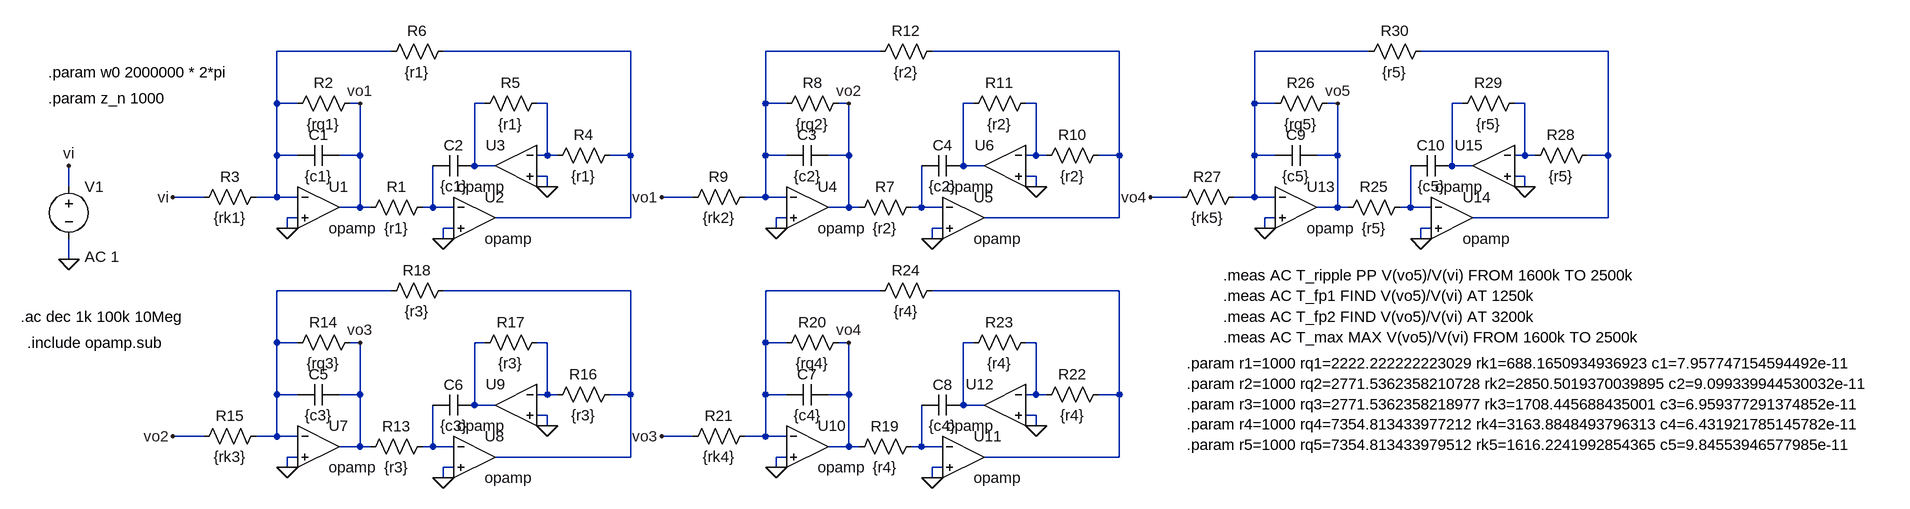
[diagram p0: schematic sim.asc]
sim.asc, the LTspice schematic file:
Version 4
SHEET 1 5660 900
WIRE 976 224 800 224
WIRE 1344 224 1056 224
WIRE 1728 224 1552 224
WIRE 2096 224 1808 224
WIRE 2480 224 2304 224
WIRE 2848 224 2560 224
WIRE 800 304 800 224
WIRE 832 304 800 304
WIRE 928 304 912 304
WIRE 1120 304 1104 304
WIRE 1216 304 1200 304
WIRE 1552 304 1552 224
WIRE 1584 304 1552 304
WIRE 1680 304 1664 304
WIRE 1872 304 1856 304
WIRE 1968 304 1952 304
WIRE 2304 304 2304 224
WIRE 2336 304 2304 304
WIRE 2432 304 2416 304
WIRE 2624 304 2608 304
WIRE 2720 304 2704 304
WIRE 800 384 800 304
WIRE 832 384 800 384
WIRE 928 384 928 304
WIRE 928 384 896 384
WIRE 1216 384 1216 304
WIRE 1216 384 1200 384
WIRE 1232 384 1216 384
WIRE 1344 384 1344 224
WIRE 1344 384 1312 384
WIRE 1552 384 1552 304
WIRE 1584 384 1552 384
WIRE 1680 384 1680 304
WIRE 1680 384 1648 384
WIRE 1968 384 1968 304
WIRE 1968 384 1952 384
WIRE 1984 384 1968 384
WIRE 2096 384 2096 224
WIRE 2096 384 2064 384
WIRE 2304 384 2304 304
WIRE 2336 384 2304 384
WIRE 2432 384 2432 304
WIRE 2432 384 2400 384
WIRE 2720 384 2720 304
WIRE 2720 384 2704 384
WIRE 2736 384 2720 384
WIRE 2848 384 2848 224
WIRE 2848 384 2816 384
WIRE 1104 400 1104 304
WIRE 1136 400 1104 400
WIRE 1856 400 1856 304
WIRE 1888 400 1856 400
WIRE 2608 400 2608 304
WIRE 2640 400 2608 400
WIRE 1216 416 1200 416
WIRE 1968 416 1952 416
WIRE 2720 416 2704 416
WIRE 480 432 480 400
WIRE 1216 432 1216 416
WIRE 1968 432 1968 416
WIRE 2720 432 2720 416
WIRE 688 448 640 448
WIRE 800 448 800 384
WIRE 800 448 768 448
WIRE 832 448 800 448
WIRE 1440 448 1392 448
WIRE 1552 448 1552 384
WIRE 1552 448 1520 448
WIRE 1584 448 1552 448
WIRE 2192 448 2144 448
WIRE 2304 448 2304 384
WIRE 2304 448 2272 448
WIRE 2336 448 2304 448
WIRE 928 464 928 384
WIRE 928 464 896 464
WIRE 944 464 928 464
WIRE 1040 464 1040 400
WIRE 1040 464 1024 464
WIRE 1072 464 1040 464
WIRE 1680 464 1680 384
WIRE 1680 464 1648 464
WIRE 1696 464 1680 464
WIRE 1792 464 1792 400
WIRE 1792 464 1776 464
WIRE 1824 464 1792 464
WIRE 2432 464 2432 384
WIRE 2432 464 2400 464
WIRE 2448 464 2432 464
WIRE 2544 464 2544 400
WIRE 2544 464 2528 464
WIRE 2576 464 2544 464
WIRE 832 480 816 480
WIRE 1344 480 1344 384
WIRE 1344 480 1136 480
WIRE 1584 480 1568 480
WIRE 2096 480 2096 384
WIRE 2096 480 1888 480
WIRE 2336 480 2320 480
WIRE 2848 480 2848 384
WIRE 2848 480 2640 480
WIRE 816 496 816 480
WIRE 1072 496 1056 496
WIRE 1568 496 1568 480
WIRE 1824 496 1808 496
WIRE 2320 496 2320 480
WIRE 2576 496 2560 496
WIRE 1056 512 1056 496
WIRE 1808 512 1808 496
WIRE 2560 512 2560 496
WIRE 480 544 480 512
WIRE 976 592 800 592
WIRE 1344 592 1056 592
WIRE 1728 592 1552 592
WIRE 2096 592 1808 592
WIRE 800 672 800 592
WIRE 832 672 800 672
WIRE 928 672 912 672
WIRE 1120 672 1104 672
WIRE 1216 672 1200 672
WIRE 1552 672 1552 592
WIRE 1584 672 1552 672
WIRE 1680 672 1664 672
WIRE 1872 672 1856 672
WIRE 1968 672 1952 672
WIRE 800 752 800 672
WIRE 832 752 800 752
WIRE 928 752 928 672
WIRE 928 752 896 752
WIRE 1216 752 1216 672
WIRE 1216 752 1200 752
WIRE 1232 752 1216 752
WIRE 1344 752 1344 592
WIRE 1344 752 1312 752
WIRE 1552 752 1552 672
WIRE 1584 752 1552 752
WIRE 1680 752 1680 672
WIRE 1680 752 1648 752
WIRE 1968 752 1968 672
WIRE 1968 752 1952 752
WIRE 1984 752 1968 752
WIRE 2096 752 2096 592
WIRE 2096 752 2064 752
WIRE 1104 768 1104 672
WIRE 1136 768 1104 768
WIRE 1856 768 1856 672
WIRE 1888 768 1856 768
WIRE 1216 784 1200 784
WIRE 1968 784 1952 784
WIRE 1216 800 1216 784
WIRE 1968 800 1968 784
WIRE 688 816 640 816
WIRE 800 816 800 752
WIRE 800 816 768 816
WIRE 832 816 800 816
WIRE 1440 816 1392 816
WIRE 1552 816 1552 752
WIRE 1552 816 1520 816
WIRE 1584 816 1552 816
WIRE 928 832 928 752
WIRE 928 832 896 832
WIRE 944 832 928 832
WIRE 1040 832 1040 768
WIRE 1040 832 1024 832
WIRE 1072 832 1040 832
WIRE 1680 832 1680 752
WIRE 1680 832 1648 832
WIRE 1696 832 1680 832
WIRE 1792 832 1792 768
WIRE 1792 832 1776 832
WIRE 1824 832 1792 832
WIRE 832 848 816 848
WIRE 1344 848 1344 752
WIRE 1344 848 1136 848
WIRE 1584 848 1568 848
WIRE 2096 848 2096 752
WIRE 2096 848 1888 848
WIRE 816 864 816 848
WIRE 1072 864 1056 864
WIRE 1568 864 1568 848
WIRE 1824 864 1808 864
WIRE 1056 880 1056 864
WIRE 1808 880 1808 864
FLAG 816 496 0
FLAG 1056 512 0
FLAG 1216 432 0
FLAG 480 544 0
FLAG 480 400 vi
FLAG 640 448 vi
FLAG 928 304 vo1
FLAG 1568 496 0
FLAG 1808 512 0
FLAG 1968 432 0
FLAG 1392 448 vo1
FLAG 1680 304 vo2
FLAG 816 864 0
FLAG 1056 880 0
FLAG 1216 800 0
FLAG 640 816 vo2
FLAG 928 672 vo3
FLAG 1568 864 0
FLAG 1808 880 0
FLAG 1968 800 0
FLAG 1392 816 vo3
FLAG 1680 672 vo4
FLAG 2320 496 0
FLAG 2560 512 0
FLAG 2720 432 0
FLAG 2144 448 vo4
FLAG 2432 304 vo5
SYMBOL OpAmps\\opamp 864 400 R0
SYMATTR InstName U1
SYMATTR SpiceLine2 GBW=10G
SYMBOL OpAmps\\opamp 1104 416 R0
SYMATTR InstName U2
SYMATTR SpiceLine2 GBW=10G
SYMBOL res 1040 448 R90
WINDOW 0 0 56 VBottom 2
WINDOW 3 32 56 VTop 2
SYMATTR InstName R1
SYMATTR Value {r1}
SYMBOL cap 896 368 R90
WINDOW 0 0 32 VBottom 2
WINDOW 3 32 32 VTop 2
SYMATTR InstName C1
SYMATTR Value {c1}
SYMBOL res 928 288 R90
WINDOW 0 0 56 VBottom 2
WINDOW 3 32 56 VTop 2
SYMATTR InstName R2
SYMATTR Value {rq1}
SYMBOL res 784 432 R90
WINDOW 0 0 56 VBottom 2
WINDOW 3 32 56 VTop 2
SYMATTR InstName R3
SYMATTR Value {rk1}
SYMBOL OpAmps\\opamp 1168 336 M0
SYMATTR InstName U3
SYMATTR SpiceLine2 GBW=10G
SYMBOL res 1328 368 R90
WINDOW 0 0 56 VBottom 2
WINDOW 3 32 56 VTop 2
SYMATTR InstName R4
SYMATTR Value {r1}
SYMBOL res 1216 288 R90
WINDOW 0 0 56 VBottom 2
WINDOW 3 32 56 VTop 2
SYMATTR InstName R5
SYMATTR Value {r1}
SYMBOL cap 1104 384 R90
WINDOW 0 0 32 VBottom 2
WINDOW 3 32 32 VTop 2
SYMATTR InstName C2
SYMATTR Value {c1}
SYMBOL res 1072 208 R90
WINDOW 0 0 56 VBottom 2
WINDOW 3 32 56 VTop 2
SYMATTR InstName R6
SYMATTR Value {r1}
SYMBOL voltage 480 416 R0
WINDOW 123 24 124 Left 2
WINDOW 39 0 0 Left 0
SYMATTR InstName V1
SYMATTR Value ""
SYMATTR Value2 AC 1
SYMBOL OpAmps\\opamp 1616 400 R0
SYMATTR InstName U4
SYMATTR SpiceLine2 GBW=10G
SYMBOL OpAmps\\opamp 1856 416 R0
SYMATTR InstName U5
SYMATTR SpiceLine2 GBW=10G
SYMBOL res 1792 448 R90
WINDOW 0 0 56 VBottom 2
WINDOW 3 32 56 VTop 2
SYMATTR InstName R7
SYMATTR Value {r2}
SYMBOL cap 1648 368 R90
WINDOW 0 0 32 VBottom 2
WINDOW 3 32 32 VTop 2
SYMATTR InstName C3
SYMATTR Value {c2}
SYMBOL res 1680 288 R90
WINDOW 0 0 56 VBottom 2
WINDOW 3 32 56 VTop 2
SYMATTR InstName R8
SYMATTR Value {rq2}
SYMBOL res 1536 432 R90
WINDOW 0 0 56 VBottom 2
WINDOW 3 32 56 VTop 2
SYMATTR InstName R9
SYMATTR Value {rk2}
SYMBOL OpAmps\\opamp 1920 336 M0
SYMATTR InstName U6
SYMATTR SpiceLine2 GBW=10G
SYMBOL res 2080 368 R90
WINDOW 0 0 56 VBottom 2
WINDOW 3 32 56 VTop 2
SYMATTR InstName R10
SYMATTR Value {r2}
SYMBOL res 1968 288 R90
WINDOW 0 0 56 VBottom 2
WINDOW 3 32 56 VTop 2
SYMATTR InstName R11
SYMATTR Value {r2}
SYMBOL cap 1856 384 R90
WINDOW 0 0 32 VBottom 2
WINDOW 3 32 32 VTop 2
SYMATTR InstName C4
SYMATTR Value {c2}
SYMBOL res 1824 208 R90
WINDOW 0 0 56 VBottom 2
WINDOW 3 32 56 VTop 2
SYMATTR InstName R12
SYMATTR Value {r2}
SYMBOL OpAmps\\opamp 864 768 R0
SYMATTR InstName U7
SYMATTR SpiceLine2 GBW=10G
SYMBOL OpAmps\\opamp 1104 784 R0
SYMATTR InstName U8
SYMATTR SpiceLine2 GBW=10G
SYMBOL res 1040 816 R90
WINDOW 0 0 56 VBottom 2
WINDOW 3 32 56 VTop 2
SYMATTR InstName R13
SYMATTR Value {r3}
SYMBOL cap 896 736 R90
WINDOW 0 0 32 VBottom 2
WINDOW 3 32 32 VTop 2
SYMATTR InstName C5
SYMATTR Value {c3}
SYMBOL res 928 656 R90
WINDOW 0 0 56 VBottom 2
WINDOW 3 32 56 VTop 2
SYMATTR InstName R14
SYMATTR Value {rq3}
SYMBOL res 784 800 R90
WINDOW 0 0 56 VBottom 2
WINDOW 3 32 56 VTop 2
SYMATTR InstName R15
SYMATTR Value {rk3}
SYMBOL OpAmps\\opamp 1168 704 M0
SYMATTR InstName U9
SYMATTR SpiceLine2 GBW=10G
SYMBOL res 1328 736 R90
WINDOW 0 0 56 VBottom 2
WINDOW 3 32 56 VTop 2
SYMATTR InstName R16
SYMATTR Value {r3}
SYMBOL res 1216 656 R90
WINDOW 0 0 56 VBottom 2
WINDOW 3 32 56 VTop 2
SYMATTR InstName R17
SYMATTR Value {r3}
SYMBOL cap 1104 752 R90
WINDOW 0 0 32 VBottom 2
WINDOW 3 32 32 VTop 2
SYMATTR InstName C6
SYMATTR Value {c3}
SYMBOL res 1072 576 R90
WINDOW 0 0 56 VBottom 2
WINDOW 3 32 56 VTop 2
SYMATTR InstName R18
SYMATTR Value {r3}
SYMBOL OpAmps\\opamp 1616 768 R0
SYMATTR InstName U10
SYMATTR SpiceLine2 GBW=10G
SYMBOL OpAmps\\opamp 1856 784 R0
SYMATTR InstName U11
SYMATTR SpiceLine2 GBW=10G
SYMBOL res 1792 816 R90
WINDOW 0 0 56 VBottom 2
WINDOW 3 32 56 VTop 2
SYMATTR InstName R19
SYMATTR Value {r4}
SYMBOL cap 1648 736 R90
WINDOW 0 0 32 VBottom 2
WINDOW 3 32 32 VTop 2
SYMATTR InstName C7
SYMATTR Value {c4}
SYMBOL res 1680 656 R90
WINDOW 0 0 56 VBottom 2
WINDOW 3 32 56 VTop 2
SYMATTR InstName R20
SYMATTR Value {rq4}
SYMBOL res 1536 800 R90
WINDOW 0 0 56 VBottom 2
WINDOW 3 32 56 VTop 2
SYMATTR InstName R21
SYMATTR Value {rk4}
SYMBOL OpAmps\\opamp 1920 704 M0
SYMATTR InstName U12
SYMATTR SpiceLine2 GBW=10G
SYMBOL res 2080 736 R90
WINDOW 0 0 56 VBottom 2
WINDOW 3 32 56 VTop 2
SYMATTR InstName R22
SYMATTR Value {r4}
SYMBOL res 1968 656 R90
WINDOW 0 0 56 VBottom 2
WINDOW 3 32 56 VTop 2
SYMATTR InstName R23
SYMATTR Value {r4}
SYMBOL cap 1856 752 R90
WINDOW 0 0 32 VBottom 2
WINDOW 3 32 32 VTop 2
SYMATTR InstName C8
SYMATTR Value {c4}
SYMBOL res 1824 576 R90
WINDOW 0 0 56 VBottom 2
WINDOW 3 32 56 VTop 2
SYMATTR InstName R24
SYMATTR Value {r4}
SYMBOL OpAmps\\opamp 2368 400 R0
SYMATTR InstName U13
SYMATTR SpiceLine2 GBW=10G
SYMBOL OpAmps\\opamp 2608 416 R0
SYMATTR InstName U14
SYMATTR SpiceLine2 GBW=10G
SYMBOL res 2544 448 R90
WINDOW 0 0 56 VBottom 2
WINDOW 3 32 56 VTop 2
SYMATTR InstName R25
SYMATTR Value {r5}
SYMBOL cap 2400 368 R90
WINDOW 0 0 32 VBottom 2
WINDOW 3 32 32 VTop 2
SYMATTR InstName C9
SYMATTR Value {c5}
SYMBOL res 2432 288 R90
WINDOW 0 0 56 VBottom 2
WINDOW 3 32 56 VTop 2
SYMATTR InstName R26
SYMATTR Value {rq5}
SYMBOL res 2288 432 R90
WINDOW 0 0 56 VBottom 2
WINDOW 3 32 56 VTop 2
SYMATTR InstName R27
SYMATTR Value {rk5}
SYMBOL OpAmps\\opamp 2672 336 M0
SYMATTR InstName U15
SYMATTR SpiceLine2 GBW=10G
SYMBOL res 2832 368 R90
WINDOW 0 0 56 VBottom 2
WINDOW 3 32 56 VTop 2
SYMATTR InstName R28
SYMATTR Value {r5}
SYMBOL res 2720 288 R90
WINDOW 0 0 56 VBottom 2
WINDOW 3 32 56 VTop 2
SYMATTR InstName R29
SYMATTR Value {r5}
SYMBOL cap 2608 384 R90
WINDOW 0 0 32 VBottom 2
WINDOW 3 32 32 VTop 2
SYMATTR InstName C10
SYMATTR Value {c5}
SYMBOL res 2576 208 R90
WINDOW 0 0 56 VBottom 2
WINDOW 3 32 56 VTop 2
SYMATTR InstName R30
SYMATTR Value {r5}
TEXT 448 256 Left 2 !.param w0 2000000 * 2*pi
TEXT 448 296 Left 2 !.param z_n 1000
TEXT 406 632 Left 2 !.ac dec 1k 100k 10Meg
TEXT 416 672 Left 2 !.include opamp.sub
TEXT 2256 568 Left 2 !.meas AC T_ripple PP V(vo5)/V(vi) FROM 1600k TO 2500k
TEXT 2256 600 Left 2 !.meas AC T_fp1 FIND V(vo5)/V(vi) AT 1250k
TEXT 2256 632 Left 2 !.meas AC T_fp2 FIND V(vo5)/V(vi) AT 3200k
TEXT 2200 704 Left 2 !.param r1=1000 rq1=2222.222222223029 rk1=688.1650934936923 c1=7.957747154594492e-11 \n.param r2=1000 rq2=2771.5362358210728 rk2=2850.5019370039895 c2=9.099339944530032e-11 \n.param r3=1000 rq3=2771.5362358218977 rk3=1708.445688435001 c3=6.959377291374852e-11 \n.param r4=1000 rq4=7354.813433977212 rk4=3163.8848493796313 c4=6.431921785145782e-11 \n.param r5=1000 rq5=7354.813433979512 rk5=1616.2241992854365 c5=9.84553946577985e-11
TEXT 2256 664 Left 2 !.meas AC T_max MAX V(vo5)/V(vi) FROM 1600k TO 2500k

The netlist it stands for:
* sim.asc
XU1 N001 0 vo1 opamp Aol=100K GBW=10G  ; pins invin noninvin out
XU2 N013 0 N002 opamp Aol=100K GBW=10G  ; pins invin noninvin out
R1 N013 vo1 {r1}
C1 vo1 N001 {c1}
R2 vo1 N001 {rq1}
R3 N001 vi {rk1}
XU3 N008 0 N007 opamp Aol=100K GBW=10G  ; pins invin noninvin out
R4 N002 N008 {r1}
R5 N008 N007 {r1}
C2 N007 N013 {c1}
R6 N002 N001 {r1}
V1 vi 0 AC 1
XU4 N003 0 vo2 opamp Aol=100K GBW=10G  ; pins invin noninvin out
XU5 N014 0 N004 opamp Aol=100K GBW=10G  ; pins invin noninvin out
R7 N014 vo2 {r2}
C3 vo2 N003 {c2}
R8 vo2 N003 {rq2}
R9 N003 vo1 {rk2}
XU6 N010 0 N009 opamp Aol=100K GBW=10G  ; pins invin noninvin out
R10 N004 N010 {r2}
R11 N010 N009 {r2}
C4 N009 N014 {c2}
R12 N004 N003 {r2}
XU7 N016 0 vo3 opamp Aol=100K GBW=10G  ; pins invin noninvin out
XU8 N024 0 N017 opamp Aol=100K GBW=10G  ; pins invin noninvin out
R13 N024 vo3 {r3}
C5 vo3 N016 {c3}
R14 vo3 N016 {rq3}
R15 N016 vo2 {rk3}
XU9 N021 0 N020 opamp Aol=100K GBW=10G  ; pins invin noninvin out
R16 N017 N021 {r3}
R17 N021 N020 {r3}
C6 N020 N024 {c3}
R18 N017 N016 {r3}
XU10 N018 0 vo4 opamp Aol=100K GBW=10G  ; pins invin noninvin out
XU11 N025 0 N019 opamp Aol=100K GBW=10G  ; pins invin noninvin out
R19 N025 vo4 {r4}
C7 vo4 N018 {c4}
R20 vo4 N018 {rq4}
R21 N018 vo3 {rk4}
XU12 N023 0 N022 opamp Aol=100K GBW=10G  ; pins invin noninvin out
R22 N019 N023 {r4}
R23 N023 N022 {r4}
C8 N022 N025 {c4}
R24 N019 N018 {r4}
XU13 N005 0 vo5 opamp Aol=100K GBW=10G  ; pins invin noninvin out
XU14 N015 0 N006 opamp Aol=100K GBW=10G  ; pins invin noninvin out
R25 N015 vo5 {r5}
C9 vo5 N005 {c5}
R26 vo5 N005 {rq5}
R27 N005 vo4 {rk5}
XU15 N012 0 N011 opamp Aol=100K GBW=10G  ; pins invin noninvin out
R28 N006 N012 {r5}
R29 N012 N011 {r5}
C10 N011 N015 {c5}
R30 N006 N005 {r5}
.param w0 2000000 * 2*pi
.param z_n 1000
.ac dec 1k 100k 10Meg
.include opamp.sub
.meas AC T_ripple PP V(vo5)/V(vi) FROM 1600k TO 2500k
.meas AC T_fp1 FIND V(vo5)/V(vi) AT 1250k
.meas AC T_fp2 FIND V(vo5)/V(vi) AT 3200k
.param r1=1000 rq1=2222.222222223029 rk1=688.1650934936923 c1=7.957747154594492e-11
.param r2=1000 rq2=2771.5362358210728 rk2=2850.5019370039895 c2=9.099339944530032e-11
.param r3=1000 rq3=2771.5362358218977 rk3=1708.445688435001 c3=6.959377291374852e-11
.param r4=1000 rq4=7354.813433977212 rk4=3163.8848493796313 c4=6.431921785145782e-11
.param r5=1000 rq5=7354.813433979512 rk5=1616.2241992854365 c5=9.84553946577985e-11
.meas AC T_max MAX V(vo5)/V(vi) FROM 1600k TO 2500k
.backanno
.end

* Results of the author's LTspice run, read from the files saved beside the schematic
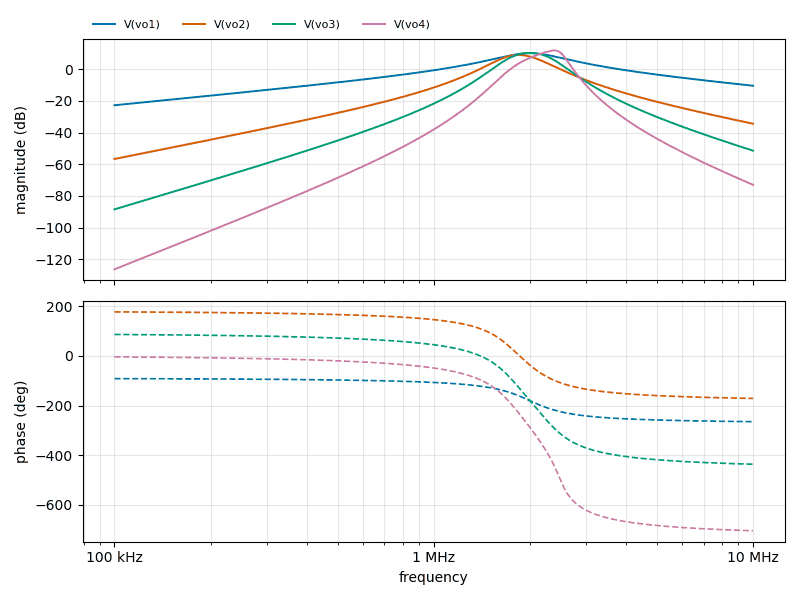
[diagram p1: AC Analysis of sim.asc, plotted from the saved traces]
* AC Analysis, 1 run:
*   V(vo1): -22.76 dB at 100 kHz, -10.42 dB at 10 MHz, peak 10.17 dB at 2 MHz, 3 dB below the peak at 1.6 MHz and 2.5 MHz
*   V(vo2): -56.69 dB at 100 kHz, -34.41 dB at 10 MHz, peak 9.03 dB at 1.841 MHz, 3 dB below the peak at 1.602 MHz and 2.138 MHz
*   V(vo3): -88.51 dB at 100 kHz, -51.45 dB at 10 MHz, peak 10.28 dB at 2 MHz, 3 dB below the peak at 1.733 MHz and 2.308 MHz
*   V(vo4): -126.37 dB at 100 kHz, -73.05 dB at 10 MHz, peak 11.91 dB at 2.388 MHz, 3 dB below the peak at 2.1 MHz and 2.538 MHz
* From the log:
*   t_ripple: PP(v(vo5)/v(vi))=(3.03871dB,-87.1735°) FROM 1.6e+06 TO 2.5e+06
*   t_fp1: v(vo5)/v(vi)=(-23.5924dB,-178.336°) at 1.25e+06
*   t_fp2: v(vo5)/v(vi)=(-23.6038dB,178.201°) at 3.2e+06
*   t_max: MAX(v(vo5)/v(vi))=(9.96982dB,-132.194°) FROM 1.6e+06 TO 2.5e+06